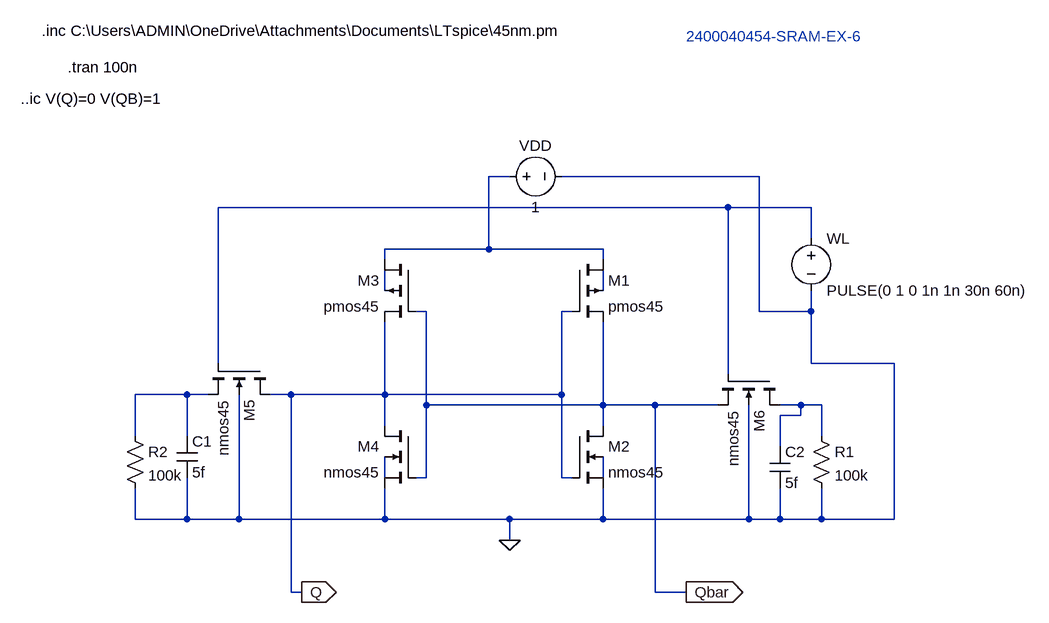
[diagram p0: schematic SRAM-Read.asc]
SRAM-Read.asc, the LTspice schematic file:
Version 4.1
SHEET 1 1028 680
WIRE 144 -368 112 -368
WIRE 528 -368 224 -368
WIRE 480 -320 -304 -320
WIRE 608 -320 480 -320
WIRE 608 -272 608 -320
WIRE 112 -256 112 -368
WIRE 112 -256 -48 -256
WIRE 288 -256 112 -256
WIRE -48 -240 -48 -256
WIRE 288 -240 288 -256
WIRE -48 -192 -48 -224
WIRE 288 -192 288 -224
WIRE 16 -160 0 -160
WIRE 240 -160 224 -160
WIRE 528 -160 528 -368
WIRE 608 -160 608 -192
WIRE 608 -160 528 -160
WIRE -304 -80 -304 -320
WIRE 608 -80 608 -160
WIRE 736 -80 608 -80
WIRE 480 -64 480 -320
WIRE -352 -32 -432 -32
WIRE -320 -32 -352 -32
WIRE -192 -32 -224 -32
WIRE -48 -32 -48 -144
WIRE -48 -32 -192 -32
WIRE 224 -32 224 -160
WIRE 224 -32 -48 -32
WIRE 16 -16 16 -160
WIRE 288 -16 288 -144
WIRE 288 -16 16 -16
WIRE 368 -16 288 -16
WIRE 464 -16 368 -16
WIRE 592 -16 560 -16
WIRE 624 -16 592 -16
WIRE 592 0 592 -16
WIRE 592 0 560 0
WIRE -48 16 -48 -32
WIRE 288 16 288 -16
WIRE -432 32 -432 -32
WIRE -352 32 -352 -32
WIRE 624 32 624 -16
WIRE 560 48 560 0
WIRE -48 96 -48 64
WIRE 16 96 16 -16
WIRE 16 96 0 96
WIRE 224 96 224 -32
WIRE 240 96 224 96
WIRE 288 96 288 64
WIRE -432 160 -432 112
WIRE -352 160 -352 96
WIRE -352 160 -432 160
WIRE -272 160 -272 -32
WIRE -272 160 -352 160
WIRE -48 160 -48 112
WIRE -48 160 -272 160
WIRE 144 160 -48 160
WIRE 288 160 288 112
WIRE 288 160 144 160
WIRE 512 160 512 -16
WIRE 512 160 288 160
WIRE 560 160 560 112
WIRE 560 160 512 160
WIRE 624 160 624 112
WIRE 624 160 560 160
WIRE 736 160 736 -80
WIRE 736 160 624 160
WIRE 144 192 144 160
WIRE -192 272 -192 -32
WIRE -176 272 -192 272
WIRE 368 272 368 -16
WIRE 416 272 368 272
FLAG 144 192 0
FLAG 416 272 Qbar
IOPIN 416 272 Out
FLAG -176 272 Q
IOPIN -176 272 Out
SYMBOL pmos4 240 -240 R0
SYMATTR InstName M1
SYMATTR Value pmos45
SYMATTR Value2 l=45n w=120n
SYMBOL nmos4 240 16 R0
SYMATTR InstName M2
SYMATTR Value nmos45
SYMATTR Value2 l=45n w=120n
SYMBOL pmos4 0 -240 M0
SYMATTR InstName M3
SYMATTR Value pmos45
SYMATTR Value2 l=45n w=120n
SYMBOL nmos4 0 16 M0
SYMATTR InstName M4
SYMATTR Value nmos45
SYMATTR Value2 l=45n w=120n
SYMBOL nmos4 -224 -80 R90
SYMATTR InstName M5
SYMATTR Value nmos45
SYMATTR Value2 l=45n w=120n
SYMBOL nmos4 560 -64 R90
SYMATTR InstName M6
SYMATTR Value nmos45
SYMATTR Value2 l=45n w=120n
SYMBOL voltage 608 -288 R0
WINDOW 123 0 0 Left 0
WINDOW 39 0 0 Left 0
SYMATTR InstName WL
SYMATTR Value PULSE(0 1 0 1n 1n 30n 60n)
SYMBOL voltage 128 -368 R270
WINDOW 0 32 56 VTop 2
WINDOW 3 -32 56 VBottom 2
WINDOW 123 0 0 Left 0
WINDOW 39 0 0 Left 0
SYMATTR InstName VDD
SYMATTR Value 1
SYMBOL cap 544 48 R0
SYMATTR InstName C2
SYMATTR Value 5f
SYMBOL cap -368 32 R0
SYMATTR InstName C1
SYMATTR Value 5f
SYMBOL res 608 16 R0
SYMATTR InstName R1
SYMATTR Value 100k
SYMBOL res -448 16 R0
SYMATTR InstName R2
SYMATTR Value 100k
TEXT -576 -592 Left 2 !.inc C:\\Users\\ADMIN\\OneDrive\\Attachments\\Documents\\LTspice\\45nm.pm
TEXT -536 -536 Left 2 !.tran 100n
TEXT -608 -488 Left 2 !..ic V(Q)=0 V(QB)=1
TEXT 416 -584 Left 2 ;2400040454-SRAM-EX-6

The netlist it stands for:
* SRAM-Read.asc
M1 N001 Q Qbar N004 pmos45 l=45n w=120n
M2 Qbar Q 0 N008 nmos45 l=45n w=120n
M3 N001 Qbar Q N003 pmos45 l=45n w=120n
M4 Q Qbar 0 N007 nmos45 l=45n w=120n
M5 Q N002 N005 0 nmos45 l=45n w=120n
M6 N006 N002 Qbar 0 nmos45 l=45n w=120n
V§WL N002 0 PULSE(0 1 0 1n 1n 30n 60n)
VDD N001 0 1
C2 N006 0 5f
C1 N005 0 5f
R1 N006 0 100k
R2 N005 0 100k
.model NMOS NMOS
.model PMOS PMOS
.lib standard.mos
.inc C:\Users\ADMIN\OneDrive\Attachments\Documents\LTspice\45nm.pm
.tran 100n
..ic V(Q)=0 V(QB)=1
* 2400040454-SRAM-EX-6
.backanno
.end

* Results of the author's LTspice run, read from the files saved beside the schematic
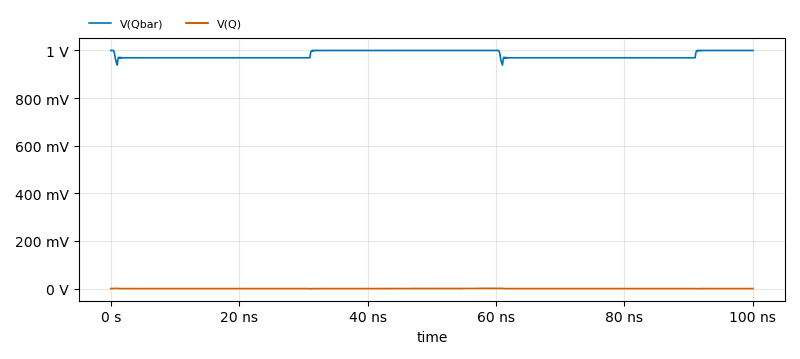
[diagram p1: Transient Analysis of SRAM-Read.asc, plotted from the saved traces]
* Transient Analysis, 1 run:
*   V(Qbar): min 938.5 mV, max 1 V, average 981.2 mV, rms 981.3 mV, last 1 V
*   V(Q): min -875.5 µV, max 914.5 µV, average 2.571 µV, rms 126.6 µV, last -729.7 nV